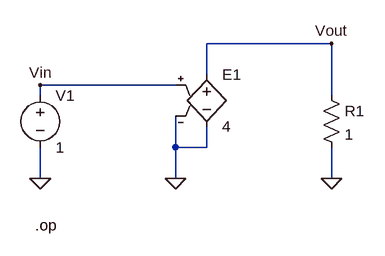
[diagram p0: schematic e_example.asc]
e_example.asc, the LTspice schematic file:
Version 4
SHEET 1 880 680
WIRE 336 80 144 80
WIRE 144 128 144 80
WIRE 96 144 -112 144
WIRE -112 160 -112 144
WIRE 336 160 336 80
WIRE 96 240 96 192
WIRE 144 240 144 208
WIRE 144 240 96 240
WIRE -112 288 -112 240
WIRE 96 288 96 240
WIRE 336 288 336 240
FLAG 96 288 0
FLAG -112 288 0
FLAG 336 80 Vout
FLAG 336 288 0
FLAG -112 144 Vin
SYMBOL e 144 112 R0
SYMATTR InstName E1
SYMATTR Value 4
SYMBOL voltage -112 144 R0
WINDOW 123 0 0 Left 0
WINDOW 39 0 0 Left 0
SYMATTR InstName V1
SYMATTR Value 1
SYMBOL res 320 144 R0
SYMATTR InstName R1
SYMATTR Value 1
TEXT -120 360 Left 0 !.op

The netlist it stands for:
* e_example.asc
E1 Vout 0 Vin 0 4
V1 Vin 0 1
R1 Vout 0 1
.op
.backanno
.end